# EAGLE schematic Weapons panel - top (EAGLE 6.5.0)
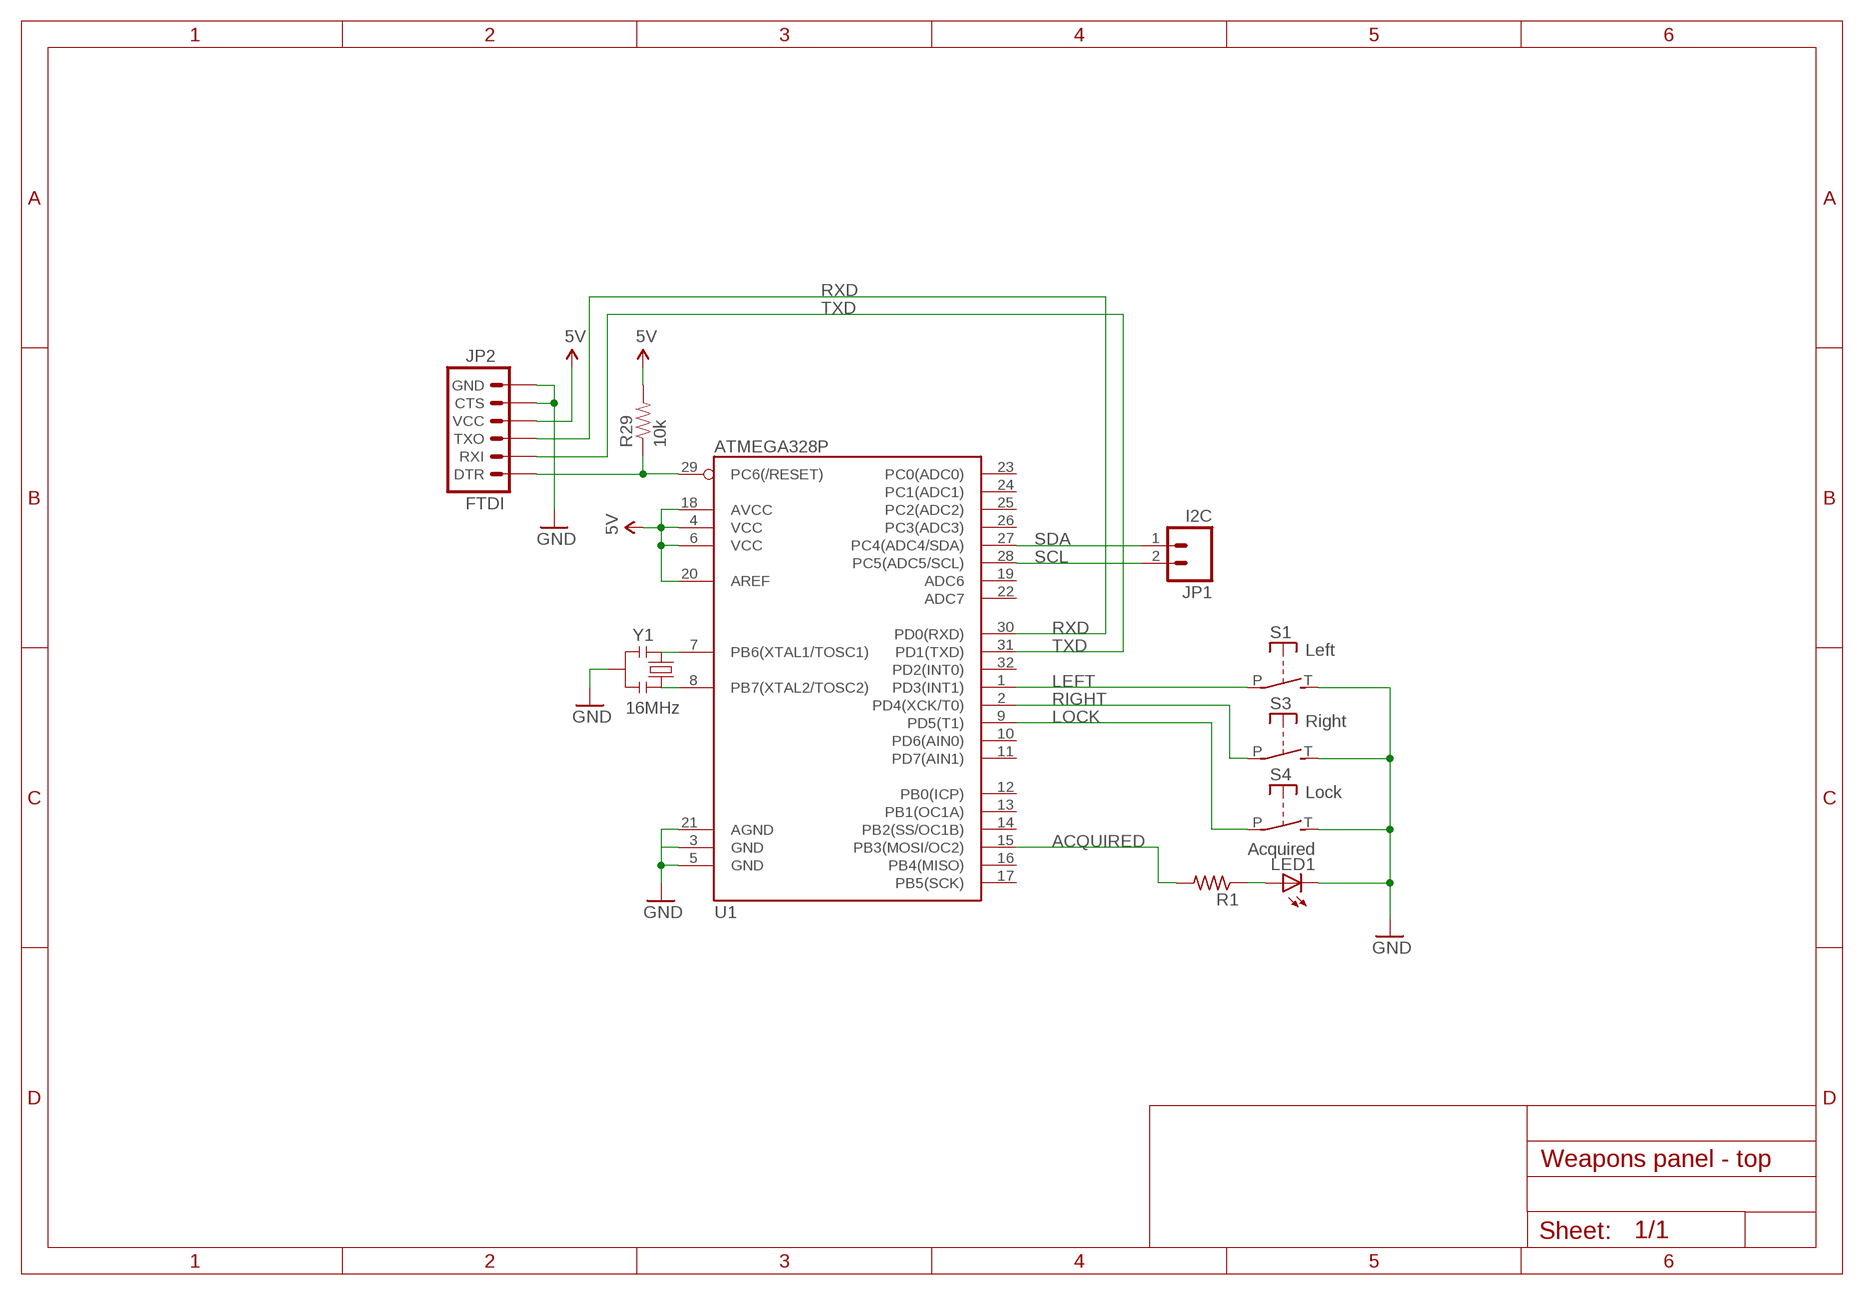
[diagram p0: schematic, sheet 1]

## Parts
JP1  I2C  M02PTH  [1X02]
JP2  FTDI  ARDUINO_SERIAL_PROGRAMPTH  [1X06]
LED1  Acquired  LED5MM  [LED5MM]
R1  R-US_0204/7  [0204/7]
R29  10k  RESISTORKIT  [AXIAL-0.3-KIT]
S1  Left  SPST  [JUDCOSPST]
S3  Right  SPST  [JUDCOSPST]
S4  Lock  SPST  [JUDCOSPST]
U1  ATMEGA328P  ATMEGA328_SMT  [TQFP32-08]
Y1  16MHz  RESONATOR16MHZ  [RESONATOR-SMD]

## Nets
5V: JP2.4(VCC) R29.P$2 U1.4(VCC) U1.6(VCC) U1.18(AVCC) U1.20(AREF)
ACQUIRED: R1.2 U1.15(PB3(MOSI/OC2))
GND: JP2.5(CTS) JP2.6(GND) LED1.K(C) S1.T(S) S3.T(S) S4.T(S) U1.3(GND) U1.5(GND) U1.21(AGND) Y1.2
LEFT: S1.P U1.1(PD3(INT1))
LOCK: S4.P U1.9(PD5(T1))
N$2: LED1.A R1.1
N$38: JP2.1(DTR) R29.P$1 U1.29(PC6(/RESET))
N$39: U1.8(PB7(XTAL2/TOSC2)) Y1.3
N$40: U1.7(PB6(XTAL1/TOSC1)) Y1.1
RIGHT: S3.P U1.2(PD4(XCK/T0))
RXD: JP2.3(TXO) U1.30(PD0(RXD))
SCL: JP1.2 U1.28(PC5(ADC5/SCL))
SDA: JP1.1 U1.27(PC4(ADC4/SDA))
TXD: JP2.2(RXI) U1.31(PD1(TXD))
Unconnected: U1.10(PD6(AIN0)) U1.11(PD7(AIN1)) U1.12(PB0(ICP)) U1.13(PB1(OC1A)) U1.14(PB2(SS/OC1B)) U1.16(PB4(MISO)) U1.17(PB5(SCK)) U1.19(ADC6) U1.22(ADC7) U1.23(PC0(ADC0)) U1.24(PC1(ADC1)) U1.25(PC2(ADC2)) U1.26(PC3(ADC3)) U1.32(PD2(INT0))

## Library data of the parts
JP1 = SparkFun-Connectors:M02: Standard 2-pin 0.1" header. Use with - straight break away headers ( PRT-00116) - right angle break away headers (PRT-00553) - swiss pins (PRT-00743) - machine pins (PRT-00117) - female headers (PRT-00115) Molex polarized connector foot print use with: PRT-08233 with associated crimp pins and housings. 2.54_SCREWTERM for use with PRT-10571. 3.5mm Screw Terminal footprints for PRT-08084 5mm Screw Terminal footprints for use with PRT-08433
JP2 = SparkFun-Connectors:ARDUINO_SERIAL_PROGRAM: FTDI connector footprints
LED1 = adafruit:LED: LED OSRAM: - CHIPLED LG R971, LG N971, LY N971, LG Q971, LY Q971, LO R971, LY R971 LH N974, LH R974 LS Q976, LO Q976, LY Q976 LO Q996 - Hyper CHIPLED LW Q18S LB Q993, LB Q99A, LB R99A - SideLED LS A670, LO A670, LY A670, LG A670, LP A670 LB A673, LV A673, LT A673, LW A673 LH A674 LY A675 LS A676, LA A676, LO A676, LY A676, LW A676 LS A679, LY A679, LG A679 - Hyper Micro SIDELED® LS Y876, LA Y876, LO Y876, LY Y876 LT Y87S - SmartLED LW L88C, LW L88S LB L89C, LB L89S, LG L890 LS L89K, LO L89K, LY L89K LS L896, LA L896, LO L896, LY L896 - TOPLED LS T670, LO T670, LY T670, LG T670, LP T670 LSG T670, LSP T670, LSY T670, LOP T670, LYG T670 LG T671, LOG T671, LSG T671 LB T673, LV T673, LT T673, LW T673 LH T674 LS T676, LA T676, LO T676, LY T676, LB T676, LH T676, LSB T676, LW T676 LB T67C, LV T67C, LT T67C, LS T67K, LO T67K, LY T67K, LW E67C LS E67B, LA E67B, LO E67B, LY E67B, LB E67C, LV E67C, LT E67C LW T67C LS T679, LY T679, LG T679 LS T770, LO T770, LY T770, LG T770, LP T770 LB T773, LV T773, LT T773, LW T773 LH T774 LS E675, LA E675, LY E675, LS T675 LS T776, LA T776, LO T776, LY T776, LB T776 LHGB T686 LT T68C, LB T68C - Hyper Mini TOPLED® LB M676 - Mini TOPLED Santana® LG M470 LS M47K, LO M47K, LY M47K Source: http://www.osram.convergy.de/
R1 = resistor:R-US_: RESISTOR, American symbol
R29 = SparkFun-Passives:RESISTOR: Resistor Basic schematic elements and footprints for 0603, 1206, and PTH resistors.
S1 S3 S4 = adafruit:SPST: Judco 50-0015-00
U1 = SparkFun-DigitalIC:ATMEGA328_SMT: 32-Pin Atmega328 part Commonly used on Arduino compatible boards Available in QFP and QFN packages TQFP is IC-09069 QFN is non-stock; PROD_ID: IC-09069
Y1 = SparkFun-FreqCtrl:RESONATOR: Resonator Small SMD resonator. Used, eg, on the Arduino Pro/ Pro Mini boards. 8MHz- XTAL-08895 16MHz- XTAL-08900; PROD_ID: XTAL-08900